# Altium schematic sheet Sim800.SchDoc
size A
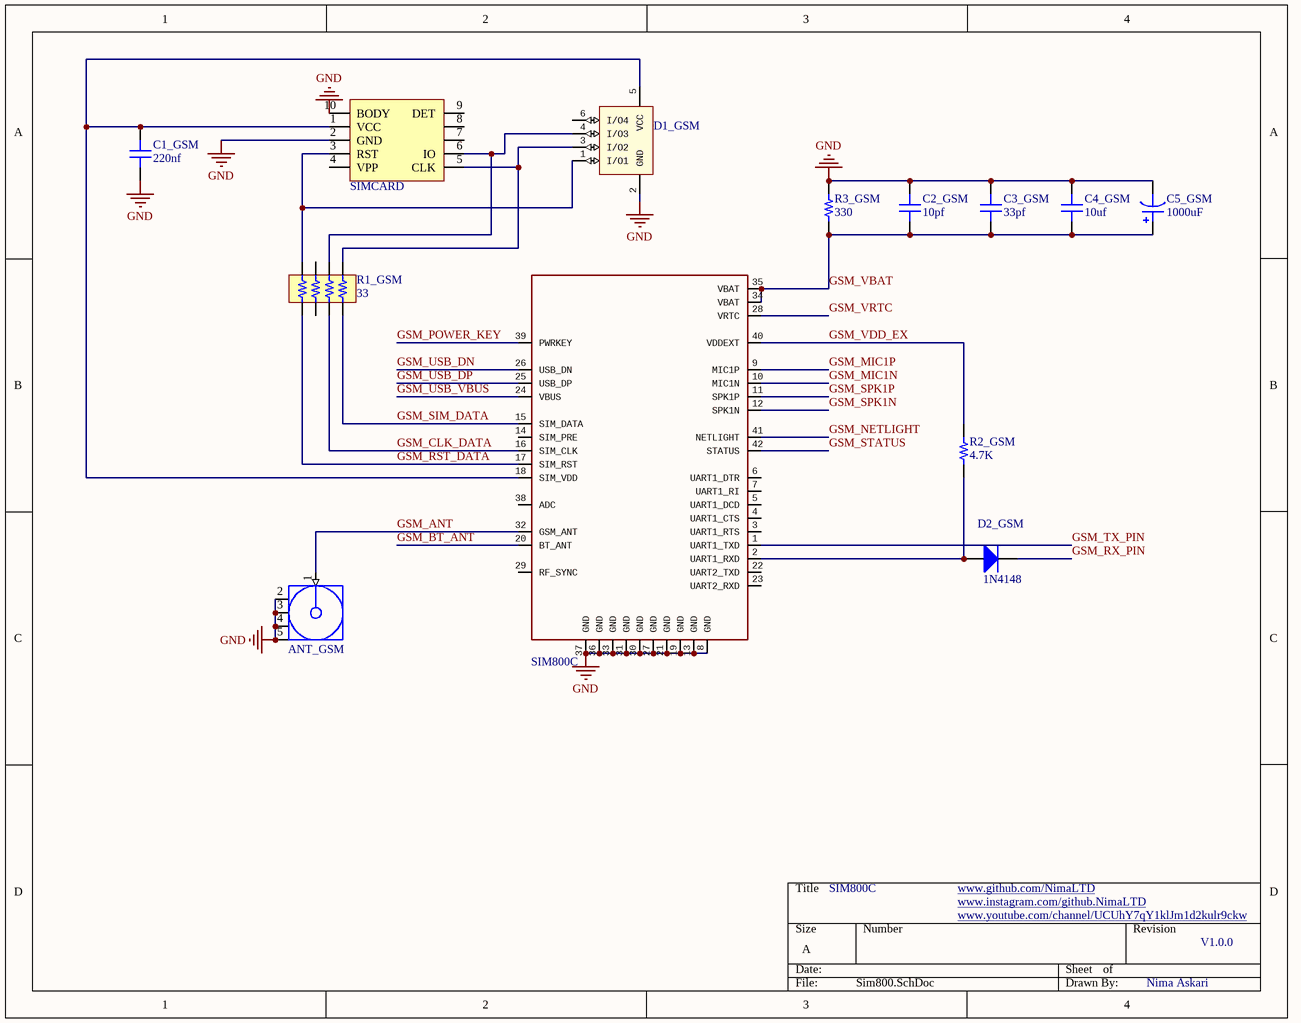
[diagram p0: Sim800.SchDoc]

## Parts
ANT_GSM  SMA  [SMA_RA]  (value not drawn)
C1_GSM  220nf  [CAP 0805]
C2_GSM  10pf  [CAP 0805]
C3_GSM  33pf  [CAP 0805]
C4_GSM  10uf  [CAP 0805]
C5_GSM  1000uF  [CAP AL SMD D8 H10]
D1_GSM  TVS ARRAY  [SOT23-6]  (value not drawn)
D2_GSM  Parameter 1: 1N4148  [SOD80]  (hidden comment: 1N4148 SMD)
R1_GSM  33  [RES PACK 0603]
R2_GSM  4.7K  [RES 0805]
R3_GSM  330  [RES 0805]
SIM800C  SIM800C  [M_Sim800C]  (value not drawn)
SIMCARD  SimCard Type3  [SIMCARD_TYPE3]  (value not drawn)

## Nets
GND: ANT_GSM.2(GND) ANT_GSM.3(GND) ANT_GSM.4(GND) ANT_GSM.5(GND) C1_GSM.1 C2_GSM.2 C3_GSM.2 C4_GSM.2 C5_GSM.2 D1_GSM.2(GND) R3_GSM.2 SIM800C.8(GND) SIM800C.13(GND) SIM800C.19(GND) SIM800C.21(GND) SIM800C.27(GND) SIM800C.30(GND) SIM800C.31(GND) SIM800C.33(GND) SIM800C.36(GND) SIM800C.37(GND) SIMCARD.2(GND) SIMCARD.10(BODY)
GSM_ANT: ANT_GSM.1(Signal) SIM800C.32(GSM_ANT)
GSM_BT_ANT: SIM800C.20(BT_ANT)
GSM_CLK_DATA: R1_GSM.5 SIM800C.16(SIM_CLK)
GSM_MIC1N: SIM800C.10(MIC1N)
GSM_MIC1P: SIM800C.9(MIC1P)
GSM_NETLIGHT: SIM800C.41(NETLIGHT)
GSM_POWER_KEY: SIM800C.39(PWRKEY)
GSM_RST_DATA: R1_GSM.1 SIM800C.17(SIM_RST)
GSM_RX_PIN: D2_GSM.2(K)
GSM_SIM_DATA: R1_GSM.7 SIM800C.15(SIM_DATA)
GSM_SPK1N: SIM800C.12(SPK1N)
GSM_SPK1P: SIM800C.11(SPK1P)
GSM_STATUS: SIM800C.42(STATUS)
GSM_TX_PIN: SIM800C.1(UART1_TXD)
GSM_USB_DN: SIM800C.26(USB_DN)
GSM_USB_DP: SIM800C.25(USB_DP)
GSM_USB_VBUS: SIM800C.24(VBUS)
GSM_VBAT: C2_GSM.1 C3_GSM.1 C4_GSM.1 C5_GSM.1 R3_GSM.1 SIM800C.34(VBAT) SIM800C.35(VBAT)
GSM_VDD_EX: R2_GSM.2 SIM800C.40(VDDEXT)
GSM_VRTC: SIM800C.28(VRTC)
NetC1_GSM_2: C1_GSM.2 D1_GSM.5(VCC) SIM800C.18(SIM_VDD) SIMCARD.1(VCC)
NetD1_GSM_1: D1_GSM.1(I/O1) R1_GSM.2 SIMCARD.3(RST)
NetD1_GSM_3: D1_GSM.3(I/O2) R1_GSM.8 SIMCARD.5(CLK)
NetD1_GSM_4: D1_GSM.4(I/O3) R1_GSM.6 SIMCARD.6(IO)
NetD2_GSM_1: D2_GSM.1(A) R2_GSM.1 SIM800C.2(UART1_RXD)

Not connected (* = marked no-connect by the designer): D1_GSM 6(I/O4); R1_GSM 3 4; SIM800C 3(UART1_RTS) 4(UART1_CTS) 5(UART1_DCD) 6(UART1_DTR) 7(UART1_RI) 14(SIM_PRE) 22(UART2_TXD) 23(UART2_RXD) 29(RF_SYNC) 38(ADC); SIMCARD 4(VPP) 7 8 9(DET)

## Notes on the sheet
- SIM800C
- www.github.com/NimaLTD <http://www.github.com/NimaLTD>
- www.instagram.com/github.NimaLTD <http://www.instagram.com/github.NimaLTD>
- www.youtube.com/channel/UCUhY7qY1klJm1d2kulr9ckw <http://www.youtube.com/channel/UCUhY7qY1klJm1d2kulr9ckw>
- V1.0.0
- Nima Askari

## Library data of the parts
ANT_GSM = SMA RA: RF Coaxial PCB Connector, MCX; Thru-Hole, Right-Angle Mount Socket, Blunt Post Terminal, 50 Ohm Impedance
C1_GSM C2_GSM C3_GSM C4_GSM = Cap SMD 0805: SMT Capacitor
  C1_GSM: Value: 220nf
  C2_GSM: Value: 10pf
  C3_GSM: Value: 33pf
  C4_GSM: Value: 10uf
C5_GSM = Pol Cap SMD AL D8 H10: SMT Polarised Capacitor; Value: 1000uF
D1_GSM = PRTR5V0U4D
D2_GSM = 1N4148 SMD: Signal Diode
R1_GSM = Res SMD Pack4 0603: SMD Resistor Pack; Value: 33
R2_GSM R3_GSM = Res SMD 0805: SMD Resistor
  R2_GSM: Value: 4.7K
  R3_GSM: Value: 330